# Altium schematic sheet Rele.SchDoc
size 420 x 297 mm
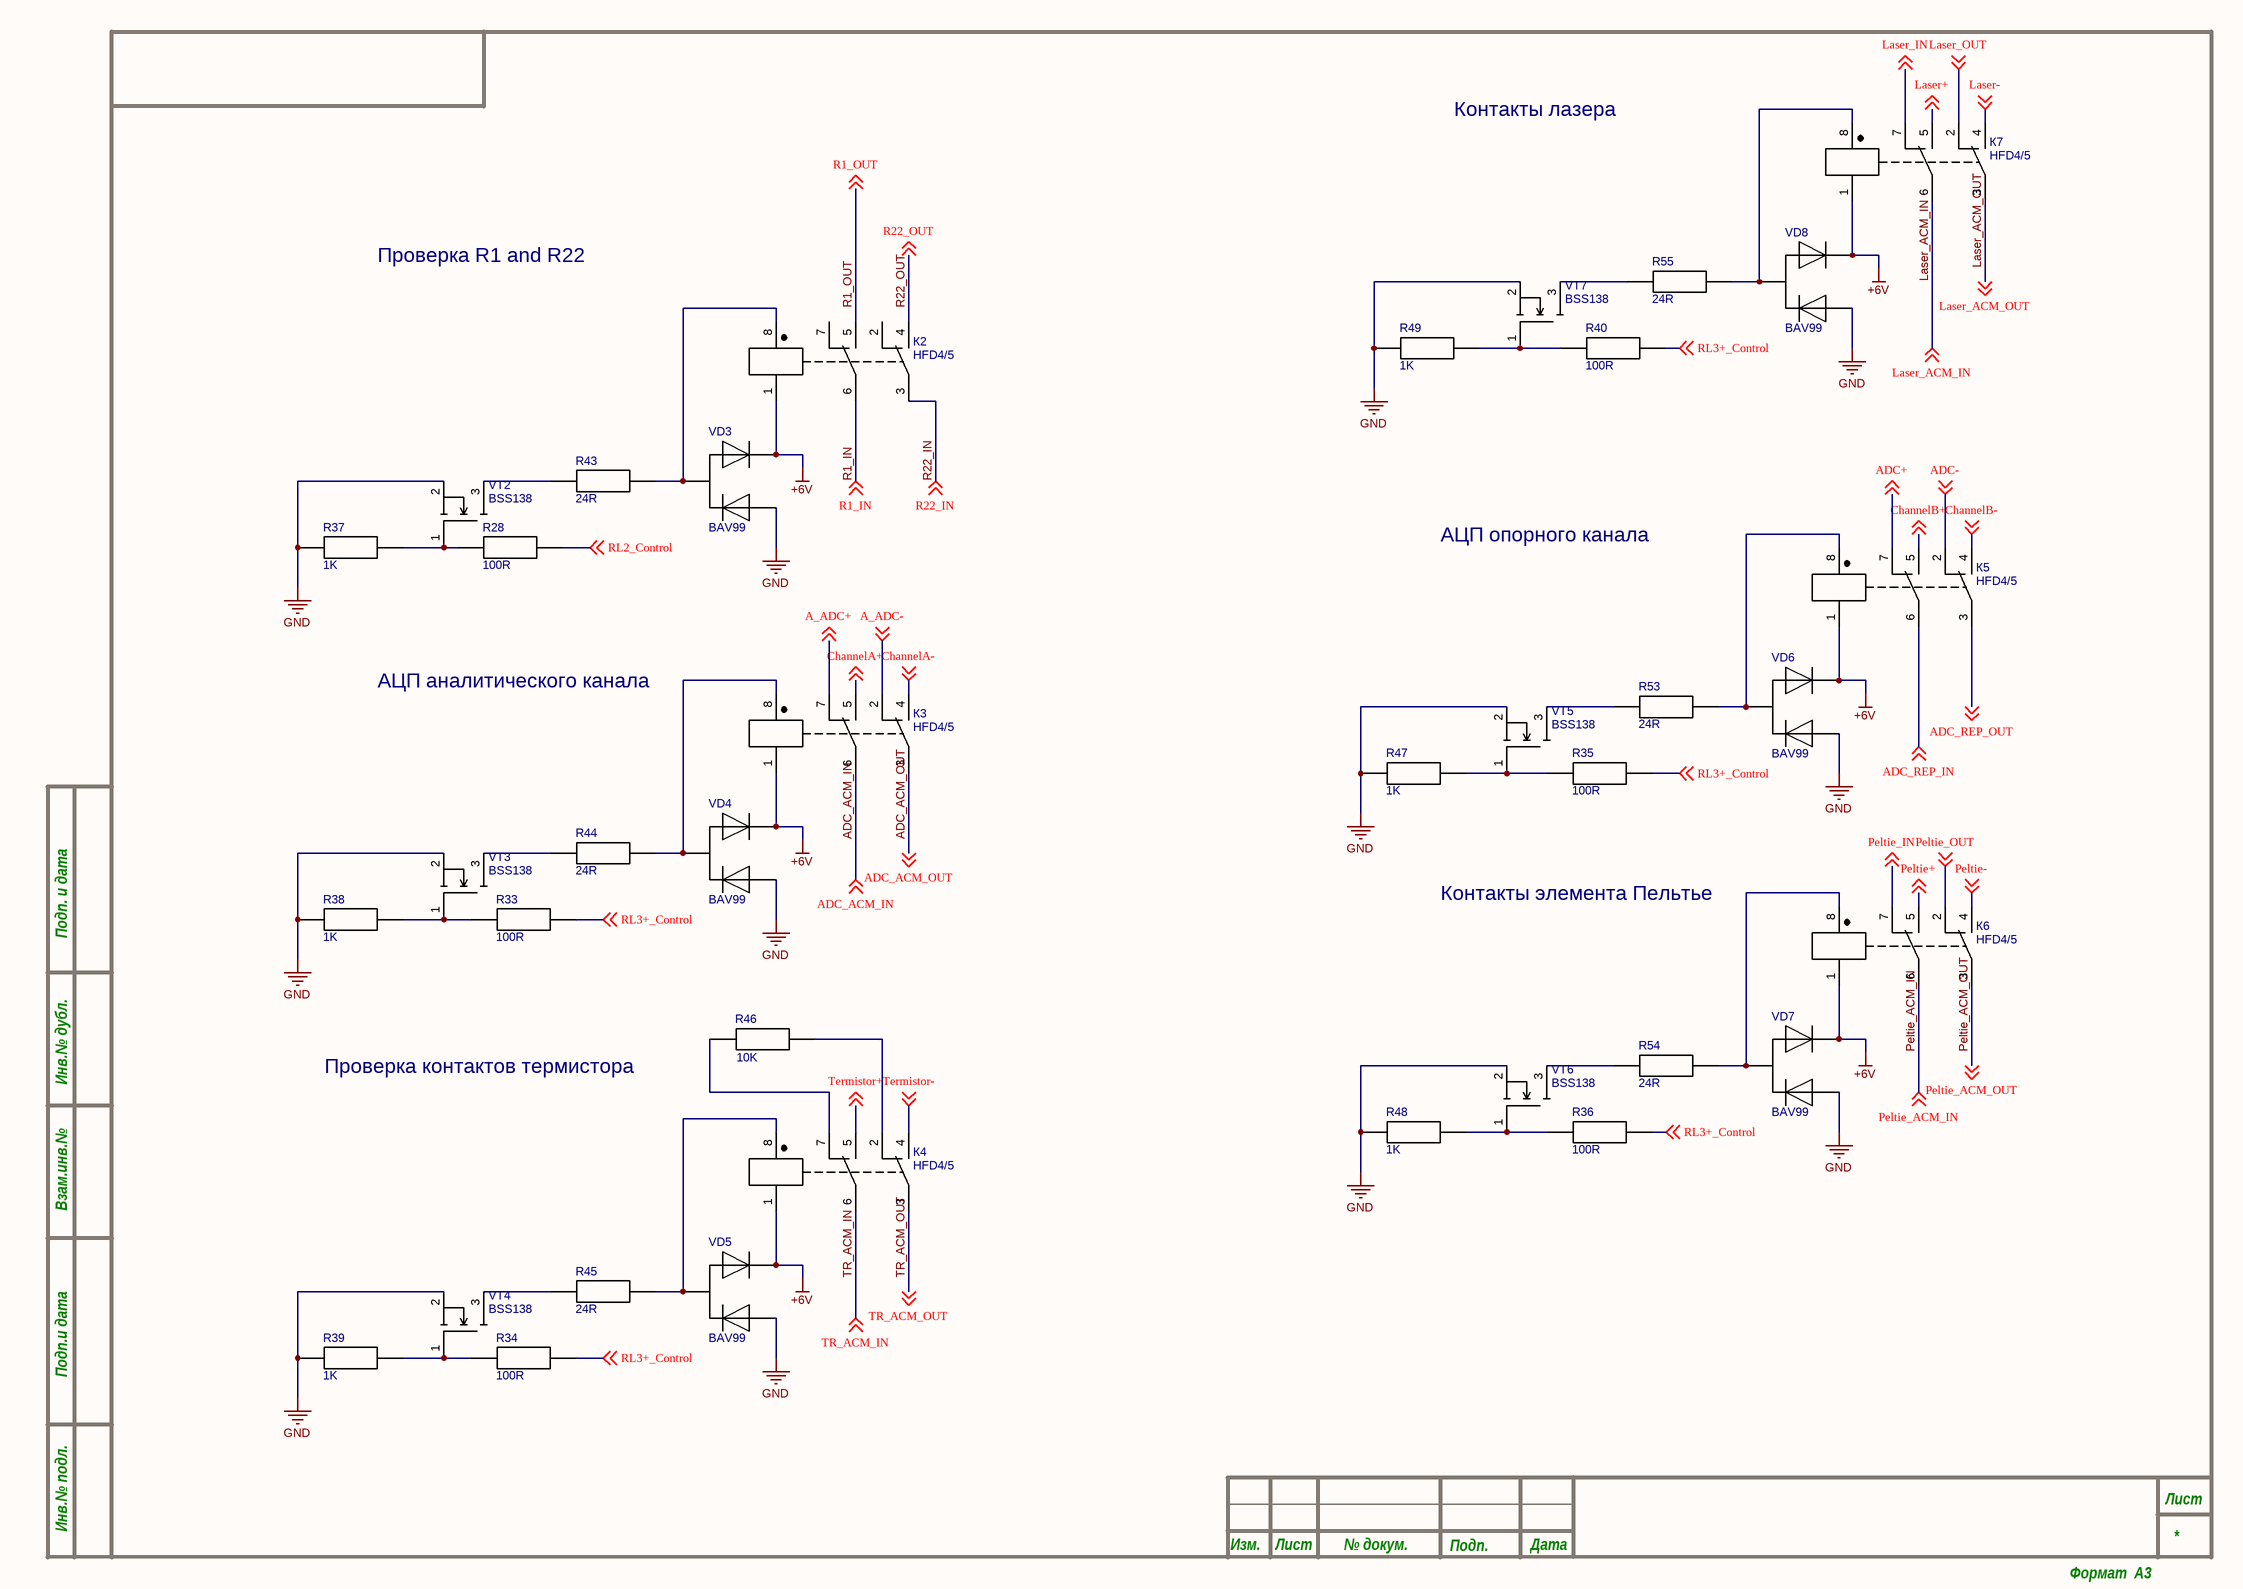
[diagram p0: Rele.SchDoc]

## Parts
R28  100R  [R0402]
R33  100R  [R0402]
R34  100R  [R0402]
R35  100R  [R0402]
R36  100R  [R0402]
R37  1K  [R0402]
R38  1K  [R0402]
R39  1K  [R0402]
R40  100R  [R0402]
R43  24R  [R0402]
R44  24R  [R0402]
R45  24R  [R0402]
R46  10K  [R0402]
R47  1K  [R0402]
R48  1K  [R0402]
R49  1K  [R0402]
R53  24R  [R0402]
R54  24R  [R0402]
R55  24R  [R0402]
VD3  BAV99  [SOT-23-3]
VD4  BAV99  [SOT-23-3]
VD5  BAV99  [SOT-23-3]
VD6  BAV99  [SOT-23-3]
VD7  BAV99  [SOT-23-3]
VD8  BAV99  [SOT-23-3]
VT2  BSS138  [SOT-23-3]
VT3  BSS138  [SOT-23-3]
VT4  BSS138  [SOT-23-3]
VT5  BSS138  [SOT-23-3]
VT6  BSS138  [SOT-23-3]
VT7  BSS138  [SOT-23-3]
К2  HFD4/5  [DIP-8]
К3  HFD4/5  [DIP-8]
К4  HFD4/5  [DIP-8]
К5  HFD4/5  [DIP-8]
К6  HFD4/5  [DIP-8]
К7  HFD4/5  [DIP-8]

## Nets
+6V: VD3.2 VD4.2 VD5.2 VD6.2 VD7.2 VD8.2 К2.1 К3.1 К4.1 К5.1 К6.1 К7.1
GND: R37.1 R38.1 R39.1 R47.1 R48.1 R49.1 VD3.1 VD4.1 VD5.1 VD6.1 VD7.1 VD8.1 VT2.2 VT3.2 VT4.2 VT5.2 VT6.2 VT7.2
A_ADC+: К3.7 ; off-sheet A_ADC+
A_ADC-: К3.2 ; off-sheet A_ADC-
ADC+: К5.7 ; off-sheet ADC+
ADC-: К5.2 ; off-sheet ADC-
ADC_ACM_IN: К3.6 ; off-sheet ADC_ACM_IN
ADC_ACM_OUT: К3.3 ; off-sheet ADC_ACM_OUT
ADC_REP_IN: К5.6 ; off-sheet ADC_REP_IN
ADC_REP_OUT: К5.3 ; off-sheet ADC_REP_OUT
ChannelA+: К3.5 ; off-sheet ChannelA+
ChannelA-: К3.4 ; off-sheet ChannelA-
ChannelB+: К5.5 ; off-sheet ChannelB+
ChannelB-: К5.4 ; off-sheet ChannelB-
Laser+: К7.5 ; off-sheet Laser+
Laser-: К7.4 ; off-sheet Laser-
Laser_ACM_IN: К7.6 ; off-sheet Laser_ACM_IN
Laser_ACM_OUT: К7.3 ; off-sheet Laser_ACM_OUT
Laser_IN: К7.7 ; off-sheet Laser_IN
Laser_OUT: К7.2 ; off-sheet Laser_OUT
Peltie+: К6.5 ; off-sheet Peltie+
Peltie-: К6.4 ; off-sheet Peltie-
Peltie_ACM_IN: К6.6 ; off-sheet Peltie_ACM_IN
Peltie_ACM_OUT: К6.3 ; off-sheet Peltie_ACM_OUT
Peltie_IN: К6.7 ; off-sheet Peltie_IN
Peltie_OUT: К6.2 ; off-sheet Peltie_OUT
R1_IN: К2.6 ; off-sheet R1_IN
R1_OUT: К2.5 ; off-sheet R1_OUT
R22_IN: К2.3 ; off-sheet R22_IN
R22_OUT: К2.4 ; off-sheet R22_OUT
RL2_Control: R28.2 ; off-sheet RL2_Control
RL3+_Control: R33.2 R34.2 R35.2 R36.2 R40.2 ; off-sheet RL3+_Control
Termistor+: К4.5 ; off-sheet Termistor+
Termistor-: К4.4 ; off-sheet Termistor-
TR_ACM_IN: К4.6 ; off-sheet TR_ACM_IN
TR_ACM_OUT: К4.3 ; off-sheet TR_ACM_OUT
NetR28_1: R28.1 R37.2 VT2.1
NetR33_1: R33.1 R38.2 VT3.1
NetR34_1: R34.1 R39.2 VT4.1
NetR35_1: R35.1 R47.2 VT5.1
NetR36_1: R36.1 R48.2 VT6.1
NetR40_1: R40.1 R49.2 VT7.1
NetR43_1: R43.1 VT2.3
NetR43_2: R43.2 VD3.3 К2.8
NetR44_1: R44.1 VT3.3
NetR44_2: R44.2 VD4.3 К3.8
NetR45_1: R45.1 VT4.3
NetR45_2: R45.2 VD5.3 К4.8
NetR46_1: R46.1 К4.7
NetR46_2: R46.2 К4.2
NetR53_1: R53.1 VT5.3
NetR53_2: R53.2 VD6.3 К5.8
NetR54_1: R54.1 VT6.3
NetR54_2: R54.2 VD7.3 К6.8
NetR55_1: R55.1 VT7.3
NetR55_2: R55.2 VD8.3 К7.8

Not connected (* = marked no-connect by the designer): К2 2 7

## Notes on the sheet
- Контакты лазера
- Проверка R1 and R22
- АЦП опорного канала
- АЦП аналитического канала
- Контакты элемента Пельтье
- Проверка контактов термистора
- Подп. и дата
- Инв.№ дубл.
- Взам.инв.№
- Подп.и дата
- Инв.№ подл.
- Изм.
- Лист
- № докум.
- Подп.
- Дата
- Формат  A3

## Library data of the parts
R28 R33-R36 R40 = R0402-100R: Resistor SMD 100R 1% 0402; Part Number: SMD RES 100 OHM 1% ±100ppm/°C 0402; Added_by: irdolgopolowa@yandex.ru; Solder_Amount: 2; Pkg: 0402; Created_at: 29/10/24; MountType: SMD; Mount: MOUNT
R37-R39 R47-R49 = R0402-1K: Resistor SMD 1K 1% 0402; Part Number: SMD RES 1 KOHM 1% ±100ppm/°C 0402; Added_by: irdolgopolowa@yandex.ru; Solder_Amount: 2; Pkg: 0402; Created_at: 29/10/24; MountType: SMD; Mount: MOUNT
R43-R45 R53-R55 = R0402-24R: Resistor SMD 24R 1% 0402; Part Number: SMD RES 24R OHM 1% ±100ppm/°C 0402; Added_by: Rutel@teslatec.ru; Solder_Amount: 2; Pkg: 0402; Created_at: 21/04/2020; MountType: SMD; Mount: MOUNT
R46 = R0402-10K: Resistor SMD 10K 1% 0402; Part Number: SMD RES 10 KOHM 1% ±100ppm/°C 0402; Added_by: Rutel@teslatec.ru; Solder_Amount: 2; Pkg: 0402; Created_at: 21/04/2020; MountType: SMD; Mount: MOUNT
VD3-VD8 = BAV99: BAV99, UMW, 70В, 200мА; Added_by: andrew@teslatec.ru; Solder_Amount: 3; Created_at: 29/06/2020; Mount: MOUNT; MountType: SMD; Pkg: SOT-23-3; Part Number: BAV99
VT2-VT7 = BSS138: N-Channel Logic Level Enhancement Mode Field Effect Transistor; Solder_Amount: 3; Added_by: ma_lubushkin@teslatec.ru; Pkg: SOT-23; Part Number: BSS138; Mount: MOUNT; MountType: SMD; Created_at: 03/12/2019
К2-К7 = HFD4/5: HFD4/5 (IM03TS) (1-1462037-8), 5VDC, 2A/250VAC DPDT; Part Number: HFD4/5SR; Added_by: irdolgopolowa@yandex.ru; Solder_Amount: 8; Created_at: 30/10/24; Mount: MOUNT; MountType: THM; Pkg: DIP-8